# Altium schematic sheet DGCtrl.SchDoc
size A2
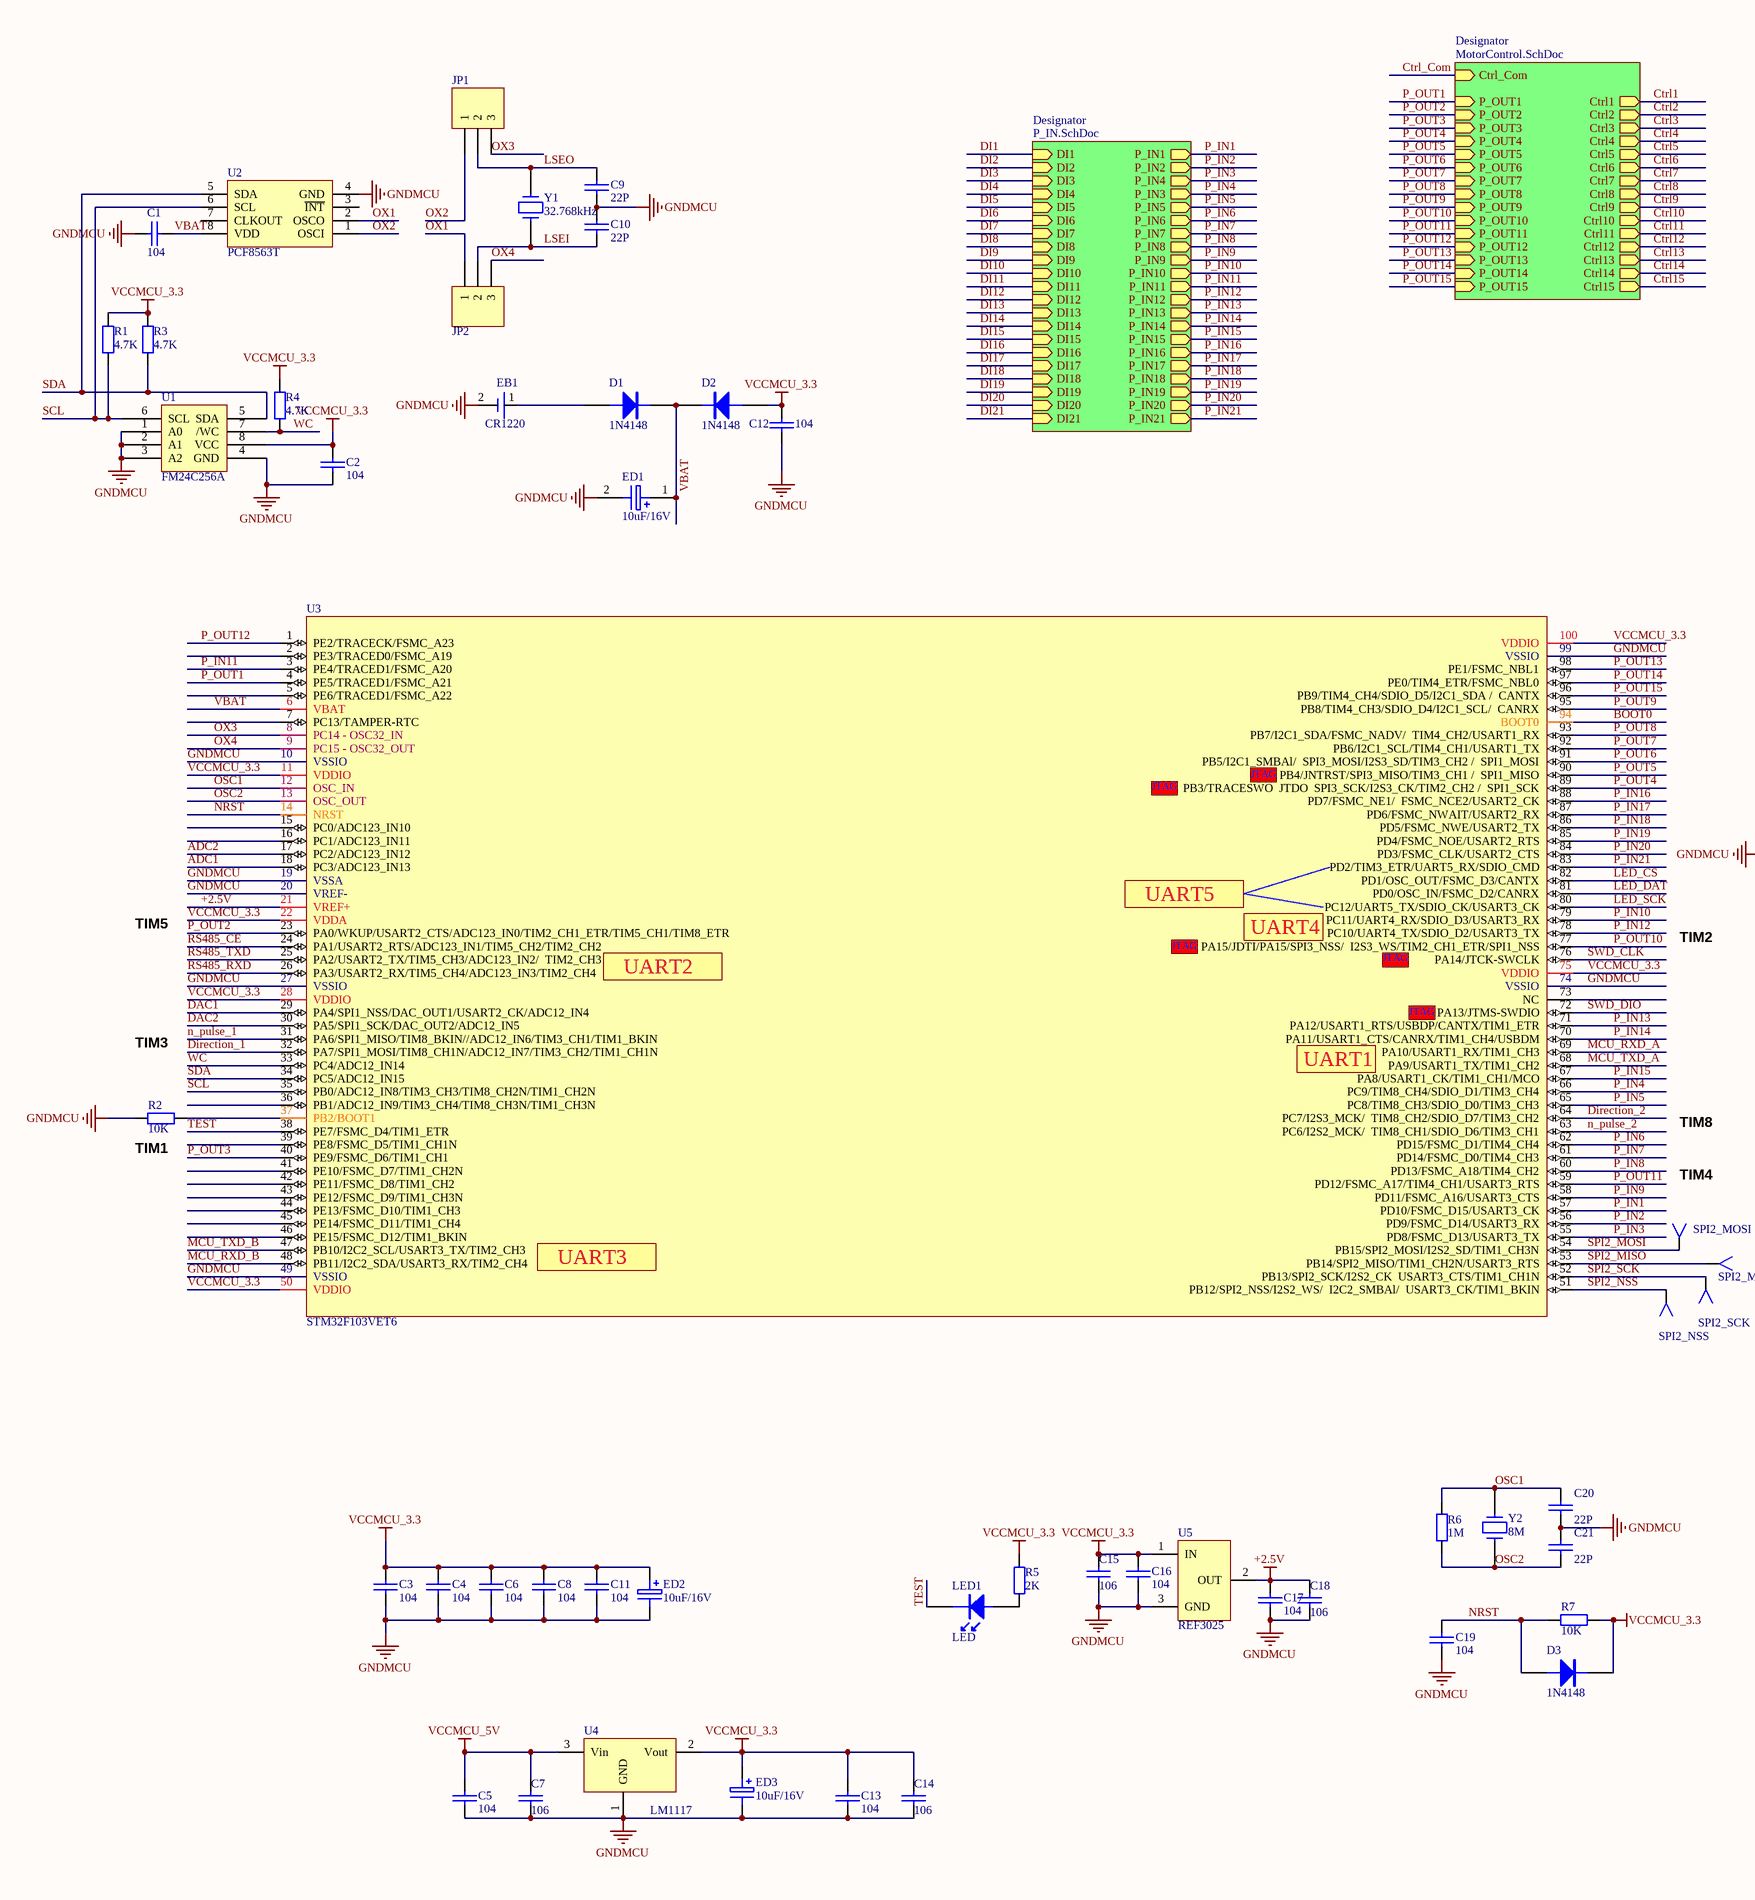
[diagram p0: DGCtrl.SchDoc, left]
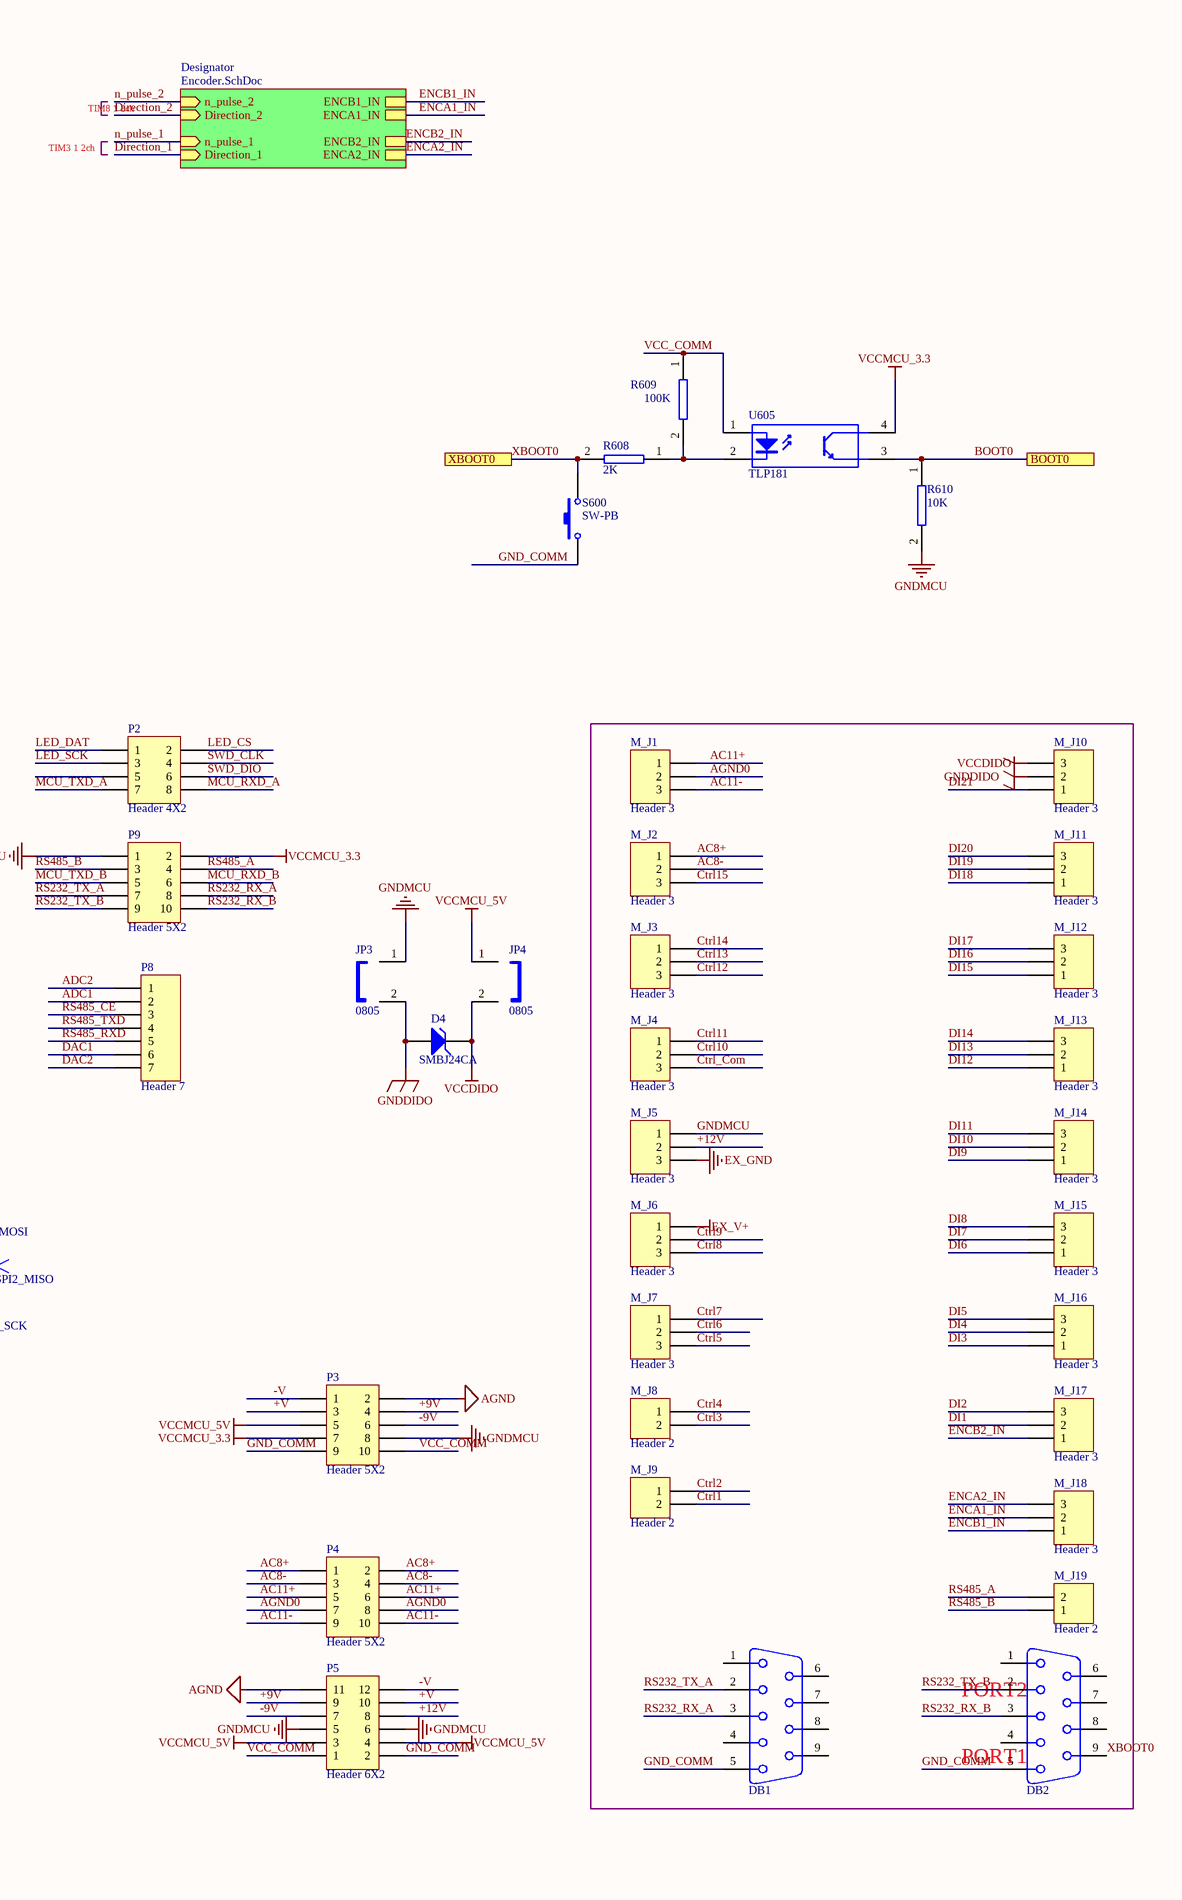
[diagram p1: DGCtrl.SchDoc, right]

## Parts
C1  104  [CAPC_E0805_2012X70N]
C2  104  [CAPC_E0805_2012X70N]
C3  104  [CAPC_E0805_2012X70N]
C4  104  [CAPC_E0805_2012X70N]
C5  104  [CAPC_E0805_2012X70N]
C6  104  [CAPC_E0805_2012X70N]
C7  106  [CAPC_E0805_2012X70N]
C8  104  [CAPC_E0805_2012X70N]
C9  22P  [CAPC_E0805_2012X70N]
C10  22P  [CAPC_E0805_2012X70N]
C11  104  [CAPC_E0805_2012X70N]
C12  104  [CAPC_E0805_2012X70N]
C13  104  [CAPC_E0805_2012X70N]
C14  106  [CAPC_E0805_2012X70N]
C15  106  [CAPC_E0805_2012X70N]
C16  104  [CAPC_E0805_2012X70N]
C17  104  [CAPC_E0805_2012X70N]
C18  106  [CAPC_E0805_2012X70N]
C19  104  [CAPC_E0805_2012X70N]
C20  22P  [CAPC_E0805_2012X70N]
C21  22P  [CAPC_E0805_2012X70N]
D1  1N4148  [N4148]
D2  1N4148  [N4148]
D3  1N4148  [N4148]
D4  SMBJ24CA  [SMB]
DB1  DB9_1  [DB9-DIP]  (value not drawn)
DB2  DB9_1  [DB9-DIP]  (value not drawn)
EB1  CR1220  [CR1220]
ED1  10uF/16V  [3528]
ED2  10uF/16V  [3528]
ED3  10uF/16V  [3528]
JP1  Header 3  [JP-3]  (value not drawn)
JP2  Header 3  [JP-3]  (value not drawn)
JP3  0805  [RESC_E0805_2012X50N]
JP4  0805  [RESC_E0805_2012X50N]
LED1  LED  [LED0805]
M_J1  Header 3  [DG5.08-3]
M_J2  Header 3  [DG5.08-3]
M_J3  Header 3  [DG5.08-3]
M_J4  Header 3  [DG5.08-3]
M_J5  Header 3  [DG5.08-3]
M_J6  Header 3  [DG5.08-3]
M_J7  Header 3  [DG5.08-3]
M_J8  Header 2  [DG5.08-2]
M_J9  Header 2  [DG5.08-2]
M_J10  Header 3  [DG5.08-3]
M_J11  Header 3  [DG5.08-3]
M_J12  Header 3  [DG5.08-3]
M_J13  Header 3  [DG5.08-3]
M_J14  Header 3  [DG5.08-3]
M_J15  Header 3  [DG5.08-3]
M_J16  Header 3  [DG5.08-3]
M_J17  Header 3  [DG5.08-3]
M_J18  Header 3  [DG5.08-3]
M_J19  Header 2  [DG5.08-2]
P2  Header 4X2  [HDR2X4]
P3  Header 5X2  [HDR2X5]
P4  Header 5X2  [HDR2X5]
P5  Header 6X2  [HDR2X6]
P8  Header 7  [HDR1X7]
P9  Header 5X2  [HDR2X5]
R1  4.7K  [RESC_E0805_2012X50N]
R2  10K  [RESC_E0805_2012X50N]
R3  4.7K  [RESC_E0805_2012X50N]
R4  4.7K  [RESC_E0805_2012X50N]
R5  2K  [RESC_E0805_2012X50N]
R6  1M  [RESC_E0805_2012X50N]
R7  10K  [RESC_E0805_2012X50N]
R608  2K  [RESC_E0805_2012X50N]
R609  100K  [RESC_E0805_2012X50N]
R610  10K  [RESC_E0805_2012X50N]
S600  SW-PB  [my-key2]
SPI2_MISO  TestPoint  [Hole]  (value not drawn)  (no BOM)
SPI2_MOSI  TestPoint  [Hole]  (value not drawn)  (no BOM)
SPI2_NSS  TestPoint  [Hole]  (value not drawn)  (no BOM)
SPI2_SCK  TestPoint  [Hole]  (value not drawn)  (no BOM)
U1  FM24C256A  [SOP8_208Mil]
U2  PCF8563T  [SO-8]
U3  STM32F103VET6  [LQFP-100]
U4  LM1117  [SOT-252]
U5  REF3025  [SOT-23]
U605  TLP181  [TLP181]
Y1  32.768kHz  [XTAL2A]
Y2  8M  [JZ]

## Sub-sheets
Designator = MotorControl.SchDoc: Ctrl_Com (in), P_OUT15 (in), Ctrl14 (out), Ctrl10 (out), Ctrl13 (out), Ctrl8 (out), Ctrl7 (out), Ctrl12 (out), P_OUT1 (in), P_OUT2 (in), P_OUT5 (in), P_OUT6 (in), P_OUT7 (in), P_OUT8 (in), P_OUT9 (in), P_OUT10 (in), P_OUT11 (in), P_OUT12 (in), P_OUT13 (in), P_OUT4 (in), P_OUT3 (in), Ctrl9 (out), Ctrl11 (out), Ctrl15 (out), Ctrl6 (out), Ctrl5 (out), Ctrl4 (out), P_OUT14 (in), Ctrl3 (out), Ctrl2 (out), Ctrl1 (out)
Designator = P_IN.SchDoc: DI13 (in), DI12 (in), DI11 (in), DI21 (in), DI20 (in), DI16 (in), DI15 (in), DI14 (in), DI19 (in), DI18 (in), DI17 (in), DI5 (in), DI6 (in), DI4 (in), DI3 (in), DI7 (in), DI10 (in), DI2 (in), P_IN5 (out), DI1 (in), DI9 (in), DI8 (in), P_IN4 (out), P_IN3 (out), P_IN2 (out), P_IN6 (out), P_IN7 (out), P_IN8 (out), P_IN9 (out), P_IN10 (out), P_IN11 (out), P_IN12 (out), P_IN13 (out), P_IN14 (out), P_IN15 (out), P_IN16 (out), P_IN17 (out), P_IN18 (out), P_IN19 (out), P_IN20 (out), P_IN21 (out), P_IN1 (out)
Designator = Encoder.SchDoc: Direction_1 (in), n_pulse_1 (in), Direction_2 (in), n_pulse_2 (in), ENCA1_IN, ENCB1_IN, ENCA2_IN, ENCB2_IN

## Ports
BOOT0, XBOOT0

## Nets
+2.5V: C17.1 C18.2 U3.21(VREF+) U5.2(OUT)
AGND: P3.2 P5.11
EX_GND: M_J5.3
EX_V+: M_J6.1
GNDDIDO: D4.1(A) JP3.2 M_J10.2
GNDMCU: C1.2 C2.1 C3.2 C4.2 C5.2 C6.2 C7.1 C8.2 C9.2 C10.1 C11.2 C12.2 C13.2 C14.1 C15.1 C16.2 C17.2 C18.1 C19.2 C20.1 C21.2 EB1.2(-) ED1.2 ED2.2 ED3.2 JP3.1 M_J5.1 P3.8 P5.5 P5.6 P9.1 R2.1 R610.2 U1.1(A0) U1.2(A1) U1.3(A2) U1.4(GND) U2.4(GND) U3.10(VSSIO) U3.19(VSSA) U3.20(VREF-) U3.27(VSSIO) U3.49(VSSIO) U3.74(VSSIO) U3.99(VSSIO) U4.1(GND) U5.3(GND)
VCCDIDO: D4.2(K) JP4.2 M_J10.3
VCCMCU_3.3: C2.2 C3.1 C4.1 C6.1 C8.1 C11.1 C12.1 C13.1 C14.2 C15.2 C16.1 D2.1(A) D3.2(K) ED2.1 ED3.1 P3.7 P9.2 R1.2 R3.2 R4.2 R5.2 R7.2 U1.8(VCC) U3.11(VDDIO) U3.22(VDDA) U3.28(VDDIO) U3.50(VDDIO) U3.75(VDDIO) U3.100(VDDIO) U4.2(Vout) U5.1(IN) U605.4
VCCMCU_5V: C5.1 C7.2 JP4.1 P3.5 P5.3 P5.4 U4.3(Vin)
+9V: P3.4 P5.9
+12V: M_J5.2 P5.8
+V: P3.3 P5.10
-9V: P3.6 P5.7
-V: P3.1 P5.12
AC8+: M_J2.1 P4.1 P4.2
AC8-: M_J2.2 P4.3 P4.4
AC11+: M_J1.1 P4.5 P4.6
AC11-: M_J1.3 P4.9 P4.10
ADC1: P8.2 U3.18(PC3/ADC123_IN13)
ADC2: P8.1 U3.17(PC2/ADC123_IN12)
AGND0: M_J1.2 P4.7 P4.8
BOOT0: R610.1 U3.94(BOOT0) U605.3 ; port BOOT0
Ctrl1: M_J9.2 ; sheet Designator/Ctrl1
Ctrl2: M_J9.1 ; sheet Designator/Ctrl2
Ctrl3: M_J8.2 ; sheet Designator/Ctrl3
Ctrl4: M_J8.1 ; sheet Designator/Ctrl4
Ctrl5: M_J7.3 ; sheet Designator/Ctrl5
Ctrl6: M_J7.2 ; sheet Designator/Ctrl6
Ctrl7: M_J7.1 ; sheet Designator/Ctrl7
Ctrl8: M_J6.3 ; sheet Designator/Ctrl8
Ctrl9: M_J6.2 ; sheet Designator/Ctrl9
Ctrl10: M_J4.2 ; sheet Designator/Ctrl10
Ctrl11: M_J4.1 ; sheet Designator/Ctrl11
Ctrl12: M_J3.3 ; sheet Designator/Ctrl12
Ctrl13: M_J3.2 ; sheet Designator/Ctrl13
Ctrl14: M_J3.1 ; sheet Designator/Ctrl14
Ctrl15: M_J2.3 ; sheet Designator/Ctrl15
Ctrl_Com: M_J4.3 ; sheet Designator/Ctrl_Com
DAC1: P8.6 U3.29(PA4/SPI1_NSS/DAC_OUT1/USART2_CK/ADC12_IN4)
DAC2: P8.7 U3.30(PA5/SPI1_SCK/DAC_OUT2/ADC12_IN5)
DI1: M_J17.2 ; sheet Designator/DI1
DI2: M_J17.3 ; sheet Designator/DI2
DI3: M_J16.1 ; sheet Designator/DI3
DI4: M_J16.2 ; sheet Designator/DI4
DI5: M_J16.3 ; sheet Designator/DI5
DI6: M_J15.1 ; sheet Designator/DI6
DI7: M_J15.2 ; sheet Designator/DI7
DI8: M_J15.3 ; sheet Designator/DI8
DI9: M_J14.1 ; sheet Designator/DI9
DI10: M_J14.2 ; sheet Designator/DI10
DI11: M_J14.3 ; sheet Designator/DI11
DI12: M_J13.1 ; sheet Designator/DI12
DI13: M_J13.2 ; sheet Designator/DI13
DI14: M_J13.3 ; sheet Designator/DI14
DI15: M_J12.1 ; sheet Designator/DI15
DI16: M_J12.2 ; sheet Designator/DI16
DI17: M_J12.3 ; sheet Designator/DI17
DI18: M_J11.1 ; sheet Designator/DI18
DI19: M_J11.2 ; sheet Designator/DI19
DI20: M_J11.3 ; sheet Designator/DI20
DI21: M_J10.1 ; sheet Designator/DI21
Direction_1: U3.32(PA7/SPI1_MOSI/TIM8_CH1N/ADC12_IN7/TIM3_CH2/TIM1_CH1N) ; sheet Designator/Direction_1
Direction_2: U3.64(PC7/I2S3_MCK/__TIM8_CH2/SDIO_D7/TIM3_CH2) ; sheet Designator/Direction_2
ENCA1_IN: M_J18.2 ; sheet Designator/ENCA1_IN
ENCA2_IN: M_J18.3 ; sheet Designator/ENCA2_IN
ENCB1_IN: M_J18.1 ; sheet Designator/ENCB1_IN
ENCB2_IN: M_J17.1 ; sheet Designator/ENCB2_IN
GND_COMM: DB1.5(GND) DB2.5(GND) P3.9 P5.2 S600.1
LED_CS: P2.2 U3.82(PD1/OSC_OUT/FSMC_D3/CANTX)
LED_DAT: P2.1 U3.81(PD0/OSC_IN/FSMC_D2/CANRX)
LED_SCK: P2.3 U3.80(PC12/UART5_TX/SDIO_CK/USART3_CK)
LSEI: C10.2 JP2.2 Y1.2
LSEO: C9.1 JP1.2 Y1.1
MCU_RXD_A: P2.8 U3.69(PA10/USART1_RX/TIM1_CH3)
MCU_RXD_B: P9.6 U3.48(PB11/I2C2_SDA/USART3_RX/TIM2_CH4)
MCU_TXD_A: P2.7 U3.68(PA9/USART1_TX/TIM1_CH2)
MCU_TXD_B: P9.5 U3.47(PB10/I2C2_SCL/USART3_TX/TIM2_CH3)
n_pulse_1: U3.31(PA6/SPI1_MISO/TIM8_BKIN//ADC12_IN6/TIM3_CH1/TIM1_BKIN) ; sheet Designator/n_pulse_1
n_pulse_2: U3.63(PC6/I2S2_MCK/__TIM8_CH1/SDIO_D6/TIM3_CH1) ; sheet Designator/n_pulse_2
NRST: C19.1 D3.1(A) R7.1 U3.14(NRST)
OSC1: C20.2 R6.2 U3.12(OSC_IN) Y2.2
OSC2: C21.1 R6.1 U3.13(OSC_OUT) Y2.1
OX1: JP2.1 U2.2(OSCO)
OX2: JP1.1 U2.1(OSCI)
OX3: JP1.3 U3.8(PC14_-_OSC32_IN)
OX4: JP2.3 U3.9(PC15_-_OSC32_OUT)
P_IN1: U3.57(PD10/FSMC_D15/USART3_CK) ; sheet Designator/P_IN1
P_IN2: U3.56(PD9/FSMC_D14/USART3_RX) ; sheet Designator/P_IN2
P_IN3: U3.55(PD8/FSMC_D13/USART3_TX) ; sheet Designator/P_IN4
P_IN4: U3.66(PC9/TIM8_CH4/SDIO_D1/TIM3_CH4) ; sheet Designator/P_IN3
P_IN5: U3.65(PC8/TIM8_CH3/SDIO_D0/TIM3_CH3) ; sheet Designator/P_IN5
P_IN6: U3.62(PD15/FSMC_D1/TIM4_CH4) ; sheet Designator/P_IN6
P_IN7: U3.61(PD14/FSMC_D0/TIM4_CH3) ; sheet Designator/P_IN7
P_IN8: U3.60(PD13/FSMC_A18/TIM4_CH2) ; sheet Designator/P_IN8
P_IN9: U3.58(PD11/FSMC_A16/USART3_CTS) ; sheet Designator/P_IN9
P_IN10: U3.79(PC11/UART4_RX/SDIO_D3/USART3_RX) ; sheet Designator/P_IN10
P_IN11: U3.3(PE4/TRACED1/FSMC_A20) ; sheet Designator/P_IN11
P_IN12: U3.78(PC10/UART4_TX/SDIO_D2/USART3_TX) ; sheet Designator/P_IN12
P_IN13: U3.71(PA12/USART1_RTS/USBDP/CANTX/TIM1_ETR) ; sheet Designator/P_IN13
P_IN14: U3.70(PA11/USART1_CTS/CANRX/TIM1_CH4/USBDM) ; sheet Designator/P_IN14
P_IN15: U3.67(PA8/USART1_CK/TIM1_CH1/MCO) ; sheet Designator/P_IN15
P_IN16: U3.88(PD7/FSMC_NE1/__FSMC_NCE2/USART2_CK) ; sheet Designator/P_IN16
P_IN17: U3.87(PD6/FSMC_NWAIT/USART2_RX) ; sheet Designator/P_IN17
P_IN18: U3.86(PD5/FSMC_NWE/USART2_TX) ; sheet Designator/P_IN18
P_IN19: U3.85(PD4/FSMC_NOE/USART2_RTS) ; sheet Designator/P_IN19
P_IN20: U3.84(PD3/FSMC_CLK/USART2_CTS) ; sheet Designator/P_IN20
P_IN21: U3.83(PD2/TIM3_ETR/UART5_RX/SDIO_CMD) ; sheet Designator/P_IN21
P_OUT1: U3.4(PE5/TRACED1/FSMC_A21) ; sheet Designator/P_OUT1
P_OUT2: U3.23(PA0/WKUP/USART2_CTS/ADC123_IN0/TIM2_CH1_ETR/TIM5_CH1/TIM8_ETR) ; sheet Designator/P_OUT2
P_OUT3: U3.40(PE9/FSMC_D6/TIM1_CH1) ; sheet Designator/P_OUT3
P_OUT4: U3.89(PB3/TRACESWO__JTDO__SPI3_SCK/I2S3_CK/TIM2_CH2_/__SPI1_SCK) ; sheet Designator/P_OUT4
P_OUT5: U3.90(PB4/JNTRST/SPI3_MISO/TIM3_CH1_/__SPI1_MISO) ; sheet Designator/P_OUT5
P_OUT6: U3.91(PB5/I2C1_SMBAl/__SPI3_MOSI/I2S3_SD/TIM3_CH2_/__SPI1_MOSI) ; sheet Designator/P_OUT6
P_OUT7: U3.92(PB6/I2C1_SCL/TIM4_CH1/USART1_TX) ; sheet Designator/P_OUT7
P_OUT8: U3.93(PB7/I2C1_SDA/FSMC_NADV/__TIM4_CH2/USART1_RX) ; sheet Designator/P_OUT8
P_OUT9: U3.95(PB8/TIM4_CH3/SDIO_D4/I2C1_SCL/__CANRX) ; sheet Designator/P_OUT9
P_OUT10: U3.77(PA15/JDTI/PA15/SPI3_NSS/__I2S3_WS/TIM2_CH1_ETR/SPI1_NSS) ; sheet Designator/P_OUT10
P_OUT11: U3.59(PD12/FSMC_A17/TIM4_CH1/USART3_RTS) ; sheet Designator/P_OUT11
P_OUT12: U3.1(PE2/TRACECK/FSMC_A23) ; sheet Designator/P_OUT12
P_OUT13: U3.98(PE1/FSMC_NBL1) ; sheet Designator/P_OUT13
P_OUT14: U3.97(PE0/TIM4_ETR/FSMC_NBL0) ; sheet Designator/P_OUT14
P_OUT15: U3.96(PB9/TIM4_CH4/SDIO_D5/I2C1_SDA_/__CANTX) ; sheet Designator/P_OUT15
RS232_RX_A: DB1.3(TXD) P9.8
RS232_RX_B: DB2.3(TXD) P9.10
RS232_TX_A: DB1.2(RXD) P9.7
RS232_TX_B: DB2.2(RXD) P9.9
RS485_A: M_J19.2 P9.4
RS485_B: M_J19.1 P9.3
RS485_CE: P8.3 U3.24(PA1/USART2_RTS/ADC123_IN1/TIM5_CH2/TIM2_CH2)
RS485_RXD: P8.5 U3.26(PA3/USART2_RX/TIM5_CH4/ADC123_IN3/TIM2_CH4)
RS485_TXD: P8.4 U3.25(PA2/USART2_TX/TIM5_CH3/ADC123_IN2/__TIM2_CH3)
SCL: R1.1 U1.6(SCL) U2.6(SCL) U3.35(PB0/ADC12_IN8/TIM3_CH3/TIM8_CH2N/TIM1_CH2N)
SDA: R3.1 U1.5(SDA) U2.5(SDA) U3.34(PC5/ADC12_IN15)
SPI2_MISO: SPI2_MISO.1 U3.53(PB14/SPI2_MISO/TIM1_CH2N/USART3_RTS)
SPI2_MOSI: SPI2_MOSI.1 U3.54(PB15/SPI2_MOSI/I2S2_SD/TIM1_CH3N)
SPI2_NSS: SPI2_NSS.1 U3.51(PB12/SPI2_NSS/I2S2_WS/__I2C2_SMBAl/__USART3_CK/TIM1_BKIN)
SPI2_SCK: SPI2_SCK.1 U3.52(PB13/SPI2_SCK/I2S2_CK__USART3_CTS/TIM1_CH1N)
SWD_CLK: P2.4 U3.76(PA14/JTCK-SWCLK)
SWD_DIO: P2.6 U3.72(PA13/JTMS-SWDIO)
TEST: LED1.2 U3.38(PE7/FSMC_D4/TIM1_ETR)
VBAT: C1.1 D1.2(K) D2.2(K) ED1.1 U2.8(VDD) U3.6(VBAT)
VCC_COMM: P3.10 P5.1 R609.1 U605.1
WC: R4.1 U1.7(/WC) U3.33(PC4/ADC12_IN14)
XBOOT0: DB2.9(DELL) R608.2 S600.2 ; port XBOOT0
NetD1_1: D1.1(A) EB1.1(+)
NetLED1_1: LED1.1 R5.1
NetR2_2: R2.2 U3.37(PB2/BOOT1)
NetR608_1: R608.1 R609.2 U605.2

Not connected (* = marked no-connect by the designer): DB1 1(DCD) 4(DTR) 6(DSR) 7(RTS) 8(CTS) 9(DELL); DB2 1(DCD) 4(DTR) 6(DSR) 7(RTS) 8(CTS); P2 5; U2 3(~{INT}) 7(CLKOUT); U3 2(PE3/TRACED0/FSMC_A19) 5(PE6/TRACED1/FSMC_A22) 7(PC13/TAMPER-RTC) 15(PC0/ADC123_IN10) 16(PC1/ADC123_IN11) 36(PB1/ADC12_IN9/TIM3_CH4/TIM8_CH3N/TIM1_CH3N) 39(PE8/FSMC_D5/TIM1_CH1N) 41(PE10/FSMC_D7/TIM1_CH2N) 42(PE11/FSMC_D8/TIM1_CH2) 43(PE12/FSMC_D9/TIM1_CH3N) 44(PE13/FSMC_D10/TIM1_CH3) 45(PE14/FSMC_D11/TIM1_CH4) 46(PE15/FSMC_D12/TIM1_BKIN) 73(NC)

## Notes on the sheet
- TIM8 1 2ch
- TIM3 1 2ch
- TIM5
- TIM2
- TIM3
- TIM8
- (near R2) TIM1
- TIM4
- (near DB2) PORT2
- (near DB2) PORT1
- (in symbol STM32F103VET6) JTAG; UART5; UART4; UART2; UART1; UART3

## Library data of the parts
C1-C21 = CAP: Capacitor
D1-D3 = DIODE
D4 = D Zener: Zener Diode; Published: 8-Jun-2000; LatestRevisionDate: 17-Jul-2002; LatestRevisionNote: Re-released for DXP Platform.; PackageReference: DIODE-0.7; Publisher: Altium Limited
DB1 DB2 = DB9_1: Female
EB1 = E-3.6V
ED1 = ELECTRO1: Electrolytic Capacitor
ED2 ED3 = ELECTRO1
JP1 JP2 M_J1-M_J7 M_J10-M_J18 = Header 3: Header, 3-Pin; LatestRevisionDate: 17-Jul-2002; LatestRevisionNote: Re-released for DXP Platform.; Publisher: Altium Limited
JP3 JP4 = JUMPER
LED1 = LED-PH
M_J8 M_J9 M_J19 = Header 2: Header, 2-Pin; LatestRevisionDate: 17-Jul-2002; LatestRevisionNote: Re-released for DXP Platform.; Publisher: Altium Limited
P2 = Header 4X2: Header, 4-Pin, Dual row; LatestRevisionDate: 17-Jul-2002; LatestRevisionNote: Re-released for DXP Platform.; Publisher: Altium Limited
P3 P4 P9 = Header 5X2: Header, 5-Pin, Dual row; LatestRevisionDate: 17-Jul-2002; LatestRevisionNote: Re-released for DXP Platform.; Publisher: Altium Limited
P5 = Header 6X2: Header, 6-Pin, Dual row; LatestRevisionDate: 17-Jul-2002; LatestRevisionNote: Re-released for DXP Platform.; Publisher: Altium Limited
P8 = Header 7: Header, 7-Pin; LatestRevisionDate: 17-Jul-2002; LatestRevisionNote: Re-released for DXP Platform.; Publisher: Altium Limited
R1-R7 = RES1
R608-R610 = RES2
S600 = SW-PB: Switch; Published: 24-Mar-1999; LatestRevisionDate: 17-Jul-2002; LatestRevisionNote: Re-released for DXP Platform.; PackageReference: SPST-2; Publisher: Altium Limited; PackageDescription: Switch; 2 Leads
U1 = FM24C256A: 1.7-5.5V宽电压 256K存储
U2 = PCF8563T: IIC RTC
U3 = STM32F103VET6: 512K Flash, 64K SRAM,LQFP100
U4 = LD1117A
U5 = REF3020: 2.048V ,HIGH OUTPUT CURRENT: 25mA,HIGH ACCURACY: 0.2%
U605 = N521-1
Y1 Y2 = CRYSTAL